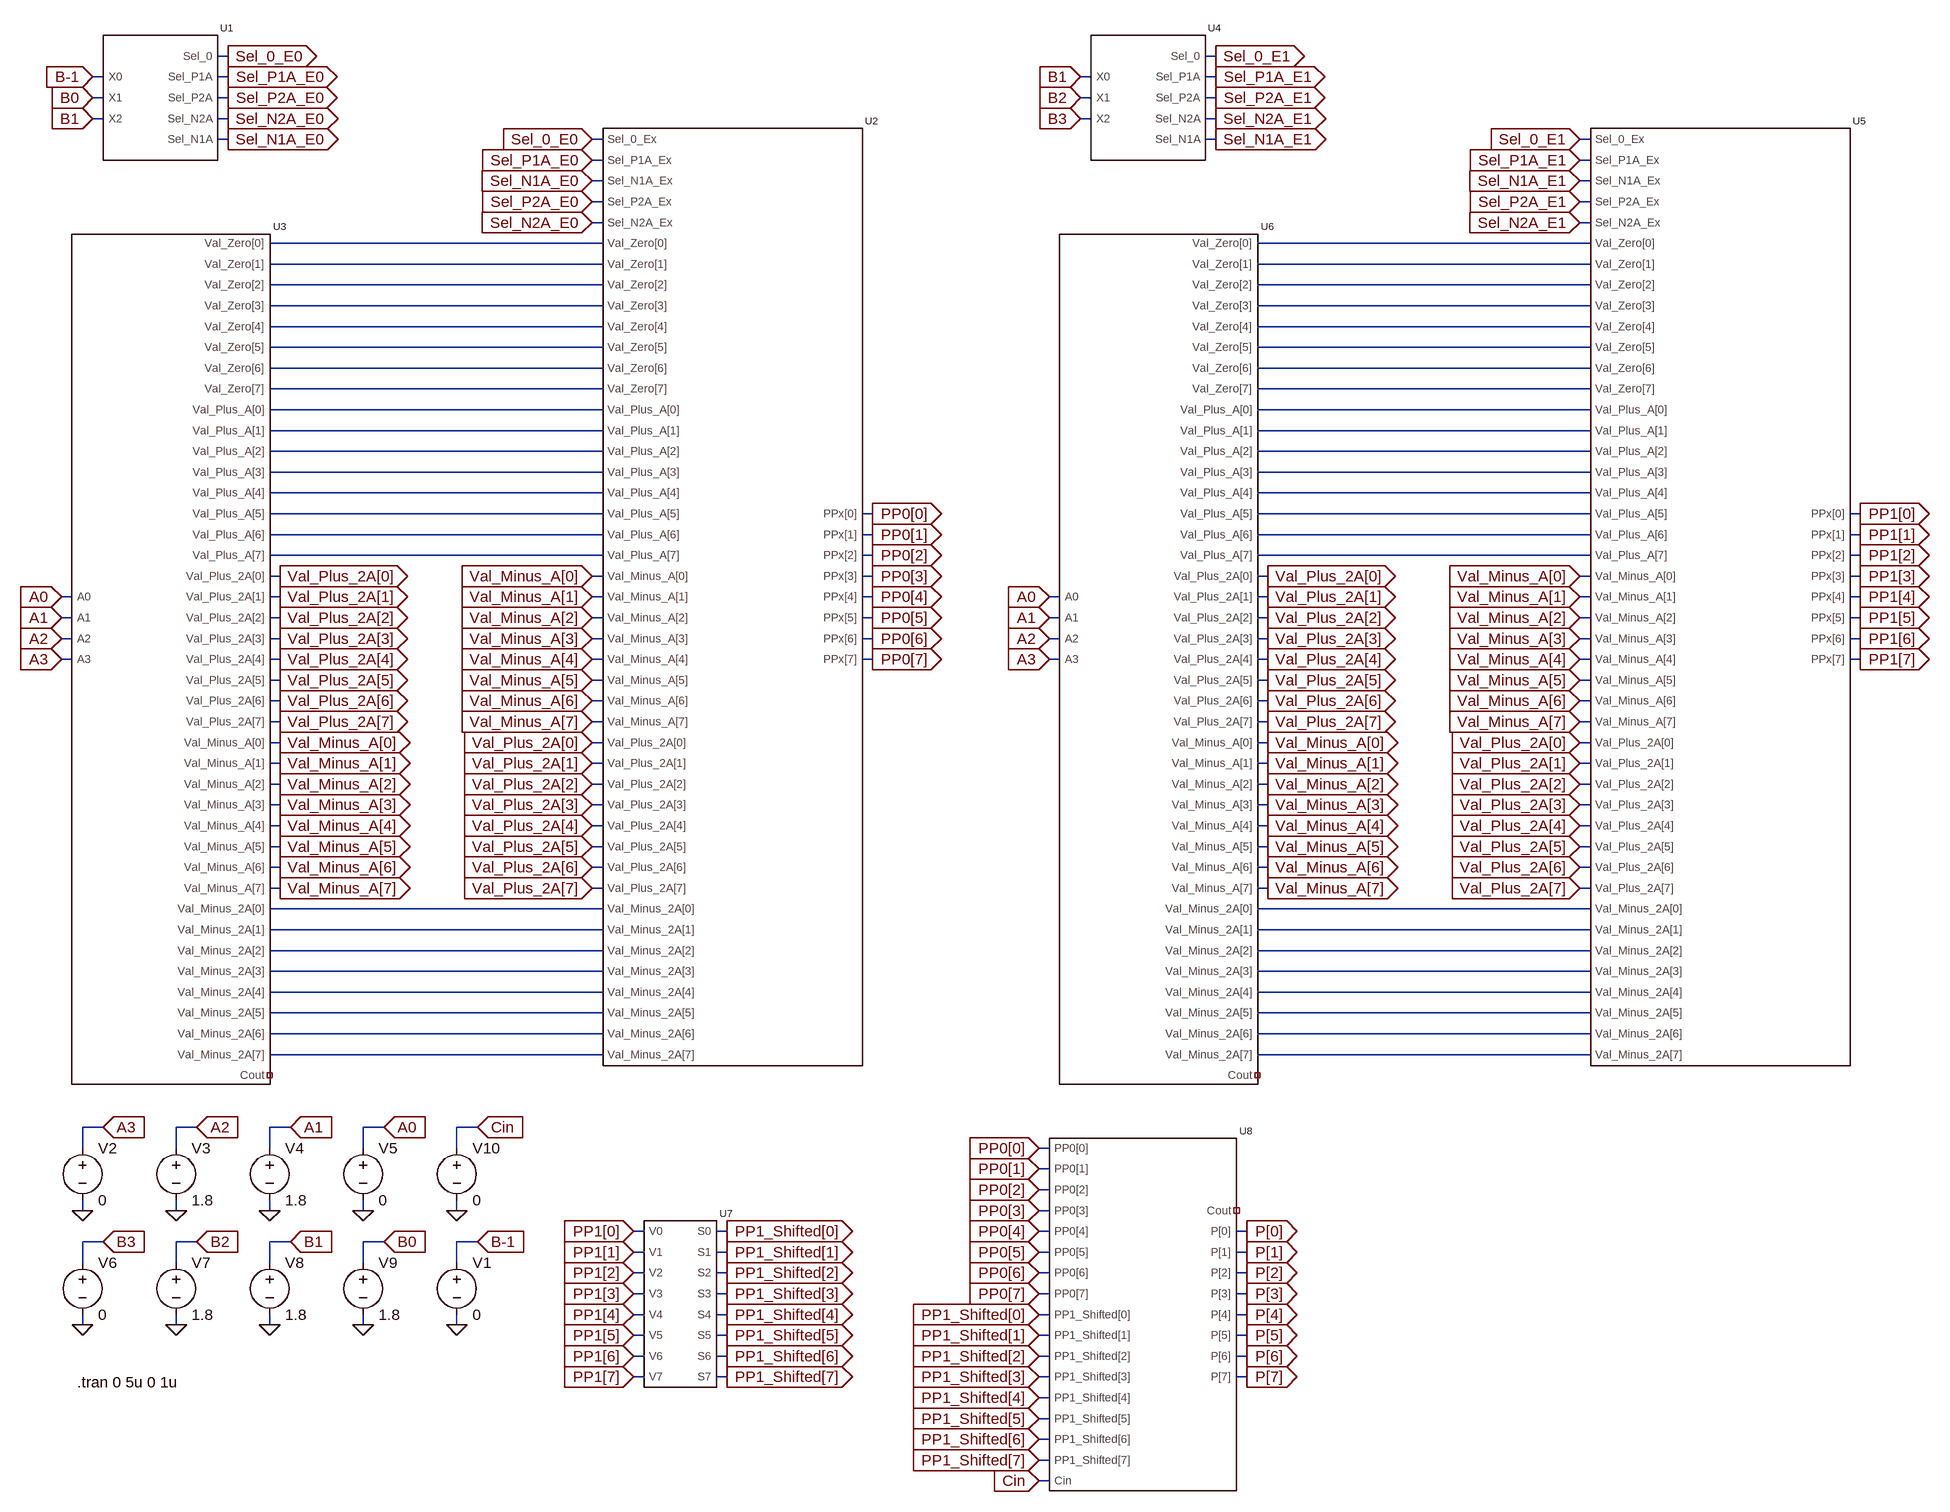
[diagram p0: schematic FINAL_DESIGN_all_blocks_included.asc]
FINAL_DESIGN_all_blocks_included.asc, the LTspice schematic file:
Version 4.1
SHEET 1 5200 2308
WIRE 1248 -96 1232 -96
WIRE 2768 -96 2752 -96
WIRE 1056 -64 1040 -64
WIRE 1248 -64 1232 -64
WIRE 2576 -64 2560 -64
WIRE 2768 -64 2752 -64
WIRE 1056 -32 1040 -32
WIRE 1248 -32 1232 -32
WIRE 2576 -32 2560 -32
WIRE 2768 -32 2752 -32
WIRE 1056 0 1040 0
WIRE 1248 0 1232 0
WIRE 2576 0 2560 0
WIRE 2768 0 2752 0
WIRE 1248 32 1232 32
WIRE 1824 32 1808 32
WIRE 2768 32 2752 32
WIRE 3344 32 3328 32
WIRE 1824 64 1808 64
WIRE 3344 64 3328 64
WIRE 1824 96 1808 96
WIRE 3344 96 3328 96
WIRE 1824 128 1808 128
WIRE 3344 128 3328 128
WIRE 1824 160 1808 160
WIRE 3344 160 3328 160
WIRE 1824 192 1312 192
WIRE 3344 192 2832 192
WIRE 1824 224 1312 224
WIRE 3344 224 2832 224
WIRE 1824 256 1312 256
WIRE 3344 256 2832 256
WIRE 1824 288 1312 288
WIRE 3344 288 2832 288
WIRE 1824 320 1312 320
WIRE 3344 320 2832 320
WIRE 1824 352 1312 352
WIRE 3344 352 2832 352
WIRE 1824 384 1312 384
WIRE 3344 384 2832 384
WIRE 1824 416 1312 416
WIRE 3344 416 2832 416
WIRE 1824 448 1312 448
WIRE 3344 448 2832 448
WIRE 1824 480 1312 480
WIRE 3344 480 2832 480
WIRE 1824 512 1312 512
WIRE 3344 512 2832 512
WIRE 1824 544 1312 544
WIRE 3344 544 2832 544
WIRE 1824 576 1312 576
WIRE 3344 576 2832 576
WIRE 1824 608 1312 608
WIRE 2240 608 2224 608
WIRE 3344 608 2832 608
WIRE 3760 608 3744 608
WIRE 1824 640 1312 640
WIRE 2240 640 2224 640
WIRE 3344 640 2832 640
WIRE 3760 640 3744 640
WIRE 1824 672 1312 672
WIRE 2240 672 2224 672
WIRE 3344 672 2832 672
WIRE 3760 672 3744 672
WIRE 1328 704 1312 704
WIRE 1824 704 1808 704
WIRE 2240 704 2224 704
WIRE 2848 704 2832 704
WIRE 3344 704 3328 704
WIRE 3760 704 3744 704
WIRE 1008 736 992 736
WIRE 1328 736 1312 736
WIRE 1824 736 1808 736
WIRE 2240 736 2224 736
WIRE 2528 736 2512 736
WIRE 2848 736 2832 736
WIRE 3344 736 3328 736
WIRE 3760 736 3744 736
WIRE 1008 768 992 768
WIRE 1328 768 1312 768
WIRE 1824 768 1808 768
WIRE 2240 768 2224 768
WIRE 2528 768 2512 768
WIRE 2848 768 2832 768
WIRE 3344 768 3328 768
WIRE 3760 768 3744 768
WIRE 1008 800 992 800
WIRE 1328 800 1312 800
WIRE 1824 800 1808 800
WIRE 2240 800 2224 800
WIRE 2528 800 2512 800
WIRE 2848 800 2832 800
WIRE 3344 800 3328 800
WIRE 3760 800 3744 800
WIRE 1008 832 992 832
WIRE 1328 832 1312 832
WIRE 1824 832 1808 832
WIRE 2240 832 2224 832
WIRE 2528 832 2512 832
WIRE 2848 832 2832 832
WIRE 3344 832 3328 832
WIRE 3760 832 3744 832
WIRE 1328 864 1312 864
WIRE 1824 864 1808 864
WIRE 2848 864 2832 864
WIRE 3344 864 3328 864
WIRE 1328 896 1312 896
WIRE 1824 896 1808 896
WIRE 2848 896 2832 896
WIRE 3344 896 3328 896
WIRE 1328 928 1312 928
WIRE 1824 928 1808 928
WIRE 2848 928 2832 928
WIRE 3344 928 3328 928
WIRE 1328 960 1312 960
WIRE 1824 960 1808 960
WIRE 2848 960 2832 960
WIRE 3344 960 3328 960
WIRE 1328 992 1312 992
WIRE 1824 992 1808 992
WIRE 2848 992 2832 992
WIRE 3344 992 3328 992
WIRE 1328 1024 1312 1024
WIRE 1824 1024 1808 1024
WIRE 2848 1024 2832 1024
WIRE 3344 1024 3328 1024
WIRE 1328 1056 1312 1056
WIRE 1824 1056 1808 1056
WIRE 2848 1056 2832 1056
WIRE 3344 1056 3328 1056
WIRE 1328 1088 1312 1088
WIRE 1824 1088 1808 1088
WIRE 2848 1088 2832 1088
WIRE 3344 1088 3328 1088
WIRE 1328 1120 1312 1120
WIRE 1824 1120 1808 1120
WIRE 2848 1120 2832 1120
WIRE 3344 1120 3328 1120
WIRE 1328 1152 1312 1152
WIRE 1824 1152 1808 1152
WIRE 2848 1152 2832 1152
WIRE 3344 1152 3328 1152
WIRE 1328 1184 1312 1184
WIRE 1824 1184 1808 1184
WIRE 2848 1184 2832 1184
WIRE 3344 1184 3328 1184
WIRE 1824 1216 1312 1216
WIRE 3344 1216 2832 1216
WIRE 1824 1248 1312 1248
WIRE 3344 1248 2832 1248
WIRE 1824 1280 1312 1280
WIRE 3344 1280 2832 1280
WIRE 1824 1312 1312 1312
WIRE 3344 1312 2832 1312
WIRE 1824 1344 1312 1344
WIRE 3344 1344 2832 1344
WIRE 1824 1376 1312 1376
WIRE 3344 1376 2832 1376
WIRE 1824 1408 1312 1408
WIRE 3344 1408 2832 1408
WIRE 1824 1440 1312 1440
WIRE 3344 1440 2832 1440
WIRE 1056 1552 1024 1552
WIRE 1200 1552 1168 1552
WIRE 1344 1552 1312 1552
WIRE 1488 1552 1456 1552
WIRE 1632 1552 1600 1552
WIRE 1024 1584 1024 1552
WIRE 1168 1584 1168 1552
WIRE 1312 1584 1312 1552
WIRE 1456 1584 1456 1552
WIRE 1600 1584 1600 1552
WIRE 2512 1584 2496 1584
WIRE 2512 1616 2496 1616
WIRE 2512 1648 2496 1648
WIRE 1024 1680 1024 1664
WIRE 1168 1680 1168 1664
WIRE 1312 1680 1312 1664
WIRE 1456 1680 1456 1664
WIRE 1600 1680 1600 1664
WIRE 2512 1680 2496 1680
WIRE 1888 1712 1872 1712
WIRE 2016 1712 2000 1712
WIRE 2512 1712 2496 1712
WIRE 2816 1712 2800 1712
WIRE 1056 1728 1024 1728
WIRE 1200 1728 1168 1728
WIRE 1344 1728 1312 1728
WIRE 1488 1728 1456 1728
WIRE 1632 1728 1600 1728
WIRE 1888 1744 1872 1744
WIRE 2016 1744 2000 1744
WIRE 2512 1744 2496 1744
WIRE 2816 1744 2800 1744
WIRE 1024 1760 1024 1728
WIRE 1168 1760 1168 1728
WIRE 1312 1760 1312 1728
WIRE 1456 1760 1456 1728
WIRE 1600 1760 1600 1728
WIRE 1888 1776 1872 1776
WIRE 2016 1776 2000 1776
WIRE 2512 1776 2496 1776
WIRE 2816 1776 2800 1776
WIRE 1888 1808 1872 1808
WIRE 2016 1808 2000 1808
WIRE 2512 1808 2496 1808
WIRE 2816 1808 2800 1808
WIRE 1888 1840 1872 1840
WIRE 2016 1840 2000 1840
WIRE 2512 1840 2496 1840
WIRE 2816 1840 2800 1840
WIRE 1024 1856 1024 1840
WIRE 1168 1856 1168 1840
WIRE 1312 1856 1312 1840
WIRE 1456 1856 1456 1840
WIRE 1600 1856 1600 1840
WIRE 1888 1872 1872 1872
WIRE 2016 1872 2000 1872
WIRE 2512 1872 2496 1872
WIRE 2816 1872 2800 1872
WIRE 1888 1904 1872 1904
WIRE 2016 1904 2000 1904
WIRE 2512 1904 2496 1904
WIRE 2816 1904 2800 1904
WIRE 1888 1936 1872 1936
WIRE 2016 1936 2000 1936
WIRE 2512 1936 2496 1936
WIRE 2816 1936 2800 1936
WIRE 2512 1968 2496 1968
WIRE 2512 2000 2496 2000
WIRE 2512 2032 2496 2032
WIRE 2512 2064 2496 2064
WIRE 2512 2096 2496 2096
FLAG 1040 0 B1
IOPIN 1040 0 In
FLAG 1040 -32 B0
IOPIN 1040 -32 In
FLAG 1040 -64 B-1
IOPIN 1040 -64 In
FLAG 1248 -96 Sel_0_E0
IOPIN 1248 -96 Out
FLAG 1248 -64 Sel_P1A_E0
IOPIN 1248 -64 Out
FLAG 1248 -32 Sel_P2A_E0
IOPIN 1248 -32 Out
FLAG 1248 0 Sel_N2A_E0
IOPIN 1248 0 Out
FLAG 1248 32 Sel_N1A_E0
IOPIN 1248 32 Out
FLAG 1808 32 Sel_0_E0
IOPIN 1808 32 In
FLAG 1808 64 Sel_P1A_E0
IOPIN 1808 64 In
FLAG 1808 128 Sel_P2A_E0
IOPIN 1808 128 In
FLAG 1808 160 Sel_N2A_E0
IOPIN 1808 160 In
FLAG 1808 96 Sel_N1A_E0
IOPIN 1808 96 In
FLAG 1328 704 Val_Plus_2A[0]
IOPIN 1328 704 Out
FLAG 1328 736 Val_Plus_2A[1]
IOPIN 1328 736 Out
FLAG 1328 768 Val_Plus_2A[2]
IOPIN 1328 768 Out
FLAG 1328 800 Val_Plus_2A[3]
IOPIN 1328 800 Out
FLAG 1328 832 Val_Plus_2A[4]
IOPIN 1328 832 Out
FLAG 1328 864 Val_Plus_2A[5]
IOPIN 1328 864 Out
FLAG 1328 896 Val_Plus_2A[6]
IOPIN 1328 896 Out
FLAG 1328 928 Val_Plus_2A[7]
IOPIN 1328 928 Out
FLAG 1808 960 Val_Plus_2A[0]
IOPIN 1808 960 In
FLAG 1808 992 Val_Plus_2A[1]
IOPIN 1808 992 In
FLAG 1808 1024 Val_Plus_2A[2]
IOPIN 1808 1024 In
FLAG 1808 1056 Val_Plus_2A[3]
IOPIN 1808 1056 In
FLAG 1808 1088 Val_Plus_2A[4]
IOPIN 1808 1088 In
FLAG 1808 1120 Val_Plus_2A[5]
IOPIN 1808 1120 In
FLAG 1808 1152 Val_Plus_2A[6]
IOPIN 1808 1152 In
FLAG 1808 1184 Val_Plus_2A[7]
IOPIN 1808 1184 In
FLAG 1328 960 Val_Minus_A[0]
IOPIN 1328 960 Out
FLAG 1328 992 Val_Minus_A[1]
IOPIN 1328 992 Out
FLAG 1328 1024 Val_Minus_A[2]
IOPIN 1328 1024 Out
FLAG 1328 1056 Val_Minus_A[3]
IOPIN 1328 1056 Out
FLAG 1328 1088 Val_Minus_A[4]
IOPIN 1328 1088 Out
FLAG 1328 1120 Val_Minus_A[5]
IOPIN 1328 1120 Out
FLAG 1328 1152 Val_Minus_A[6]
IOPIN 1328 1152 Out
FLAG 1328 1184 Val_Minus_A[7]
IOPIN 1328 1184 Out
FLAG 1808 704 Val_Minus_A[0]
IOPIN 1808 704 In
FLAG 1808 736 Val_Minus_A[1]
IOPIN 1808 736 In
FLAG 1808 768 Val_Minus_A[2]
IOPIN 1808 768 In
FLAG 1808 800 Val_Minus_A[3]
IOPIN 1808 800 In
FLAG 1808 832 Val_Minus_A[4]
IOPIN 1808 832 In
FLAG 1808 864 Val_Minus_A[5]
IOPIN 1808 864 In
FLAG 1808 896 Val_Minus_A[6]
IOPIN 1808 896 In
FLAG 1808 928 Val_Minus_A[7]
IOPIN 1808 928 In
FLAG 2240 608 PP0[0]
IOPIN 2240 608 Out
FLAG 2240 640 PP0[1]
IOPIN 2240 640 Out
FLAG 2240 672 PP0[2]
IOPIN 2240 672 Out
FLAG 2240 704 PP0[3]
IOPIN 2240 704 Out
FLAG 2240 736 PP0[4]
IOPIN 2240 736 Out
FLAG 2240 768 PP0[5]
IOPIN 2240 768 Out
FLAG 2240 800 PP0[6]
IOPIN 2240 800 Out
FLAG 2240 832 PP0[7]
IOPIN 2240 832 Out
FLAG 992 736 A0
IOPIN 992 736 In
FLAG 992 768 A1
IOPIN 992 768 In
FLAG 992 800 A2
IOPIN 992 800 In
FLAG 992 832 A3
IOPIN 992 832 In
FLAG 2560 0 B3
IOPIN 2560 0 In
FLAG 2560 -32 B2
IOPIN 2560 -32 In
FLAG 2560 -64 B1
IOPIN 2560 -64 In
FLAG 2768 -96 Sel_0_E1
IOPIN 2768 -96 Out
FLAG 2768 -64 Sel_P1A_E1
IOPIN 2768 -64 Out
FLAG 2768 -32 Sel_P2A_E1
IOPIN 2768 -32 Out
FLAG 2768 0 Sel_N2A_E1
IOPIN 2768 0 Out
FLAG 2768 32 Sel_N1A_E1
IOPIN 2768 32 Out
FLAG 3328 32 Sel_0_E1
IOPIN 3328 32 In
FLAG 3328 64 Sel_P1A_E1
IOPIN 3328 64 In
FLAG 3328 128 Sel_P2A_E1
IOPIN 3328 128 In
FLAG 3328 160 Sel_N2A_E1
IOPIN 3328 160 In
FLAG 3328 96 Sel_N1A_E1
IOPIN 3328 96 In
FLAG 2848 704 Val_Plus_2A[0]
IOPIN 2848 704 Out
FLAG 2848 736 Val_Plus_2A[1]
IOPIN 2848 736 Out
FLAG 2848 768 Val_Plus_2A[2]
IOPIN 2848 768 Out
FLAG 2848 800 Val_Plus_2A[3]
IOPIN 2848 800 Out
FLAG 2848 832 Val_Plus_2A[4]
IOPIN 2848 832 Out
FLAG 2848 864 Val_Plus_2A[5]
IOPIN 2848 864 Out
FLAG 2848 896 Val_Plus_2A[6]
IOPIN 2848 896 Out
FLAG 2848 928 Val_Plus_2A[7]
IOPIN 2848 928 Out
FLAG 3328 960 Val_Plus_2A[0]
IOPIN 3328 960 In
FLAG 3328 992 Val_Plus_2A[1]
IOPIN 3328 992 In
FLAG 3328 1024 Val_Plus_2A[2]
IOPIN 3328 1024 In
FLAG 3328 1056 Val_Plus_2A[3]
IOPIN 3328 1056 In
FLAG 3328 1088 Val_Plus_2A[4]
IOPIN 3328 1088 In
FLAG 3328 1120 Val_Plus_2A[5]
IOPIN 3328 1120 In
FLAG 3328 1152 Val_Plus_2A[6]
IOPIN 3328 1152 In
FLAG 3328 1184 Val_Plus_2A[7]
IOPIN 3328 1184 In
FLAG 2848 960 Val_Minus_A[0]
IOPIN 2848 960 Out
FLAG 2848 992 Val_Minus_A[1]
IOPIN 2848 992 Out
FLAG 2848 1024 Val_Minus_A[2]
IOPIN 2848 1024 Out
FLAG 2848 1056 Val_Minus_A[3]
IOPIN 2848 1056 Out
FLAG 2848 1088 Val_Minus_A[4]
IOPIN 2848 1088 Out
FLAG 2848 1120 Val_Minus_A[5]
IOPIN 2848 1120 Out
FLAG 2848 1152 Val_Minus_A[6]
IOPIN 2848 1152 Out
FLAG 2848 1184 Val_Minus_A[7]
IOPIN 2848 1184 Out
FLAG 3328 704 Val_Minus_A[0]
IOPIN 3328 704 In
FLAG 3328 736 Val_Minus_A[1]
IOPIN 3328 736 In
FLAG 3328 768 Val_Minus_A[2]
IOPIN 3328 768 In
FLAG 3328 800 Val_Minus_A[3]
IOPIN 3328 800 In
FLAG 3328 832 Val_Minus_A[4]
IOPIN 3328 832 In
FLAG 3328 864 Val_Minus_A[5]
IOPIN 3328 864 In
FLAG 3328 896 Val_Minus_A[6]
IOPIN 3328 896 In
FLAG 3328 928 Val_Minus_A[7]
IOPIN 3328 928 In
FLAG 3760 608 PP1[0]
IOPIN 3760 608 Out
FLAG 3760 640 PP1[1]
IOPIN 3760 640 Out
FLAG 3760 672 PP1[2]
IOPIN 3760 672 Out
FLAG 3760 704 PP1[3]
IOPIN 3760 704 Out
FLAG 3760 736 PP1[4]
IOPIN 3760 736 Out
FLAG 3760 768 PP1[5]
IOPIN 3760 768 Out
FLAG 3760 800 PP1[6]
IOPIN 3760 800 Out
FLAG 3760 832 PP1[7]
IOPIN 3760 832 Out
FLAG 2512 736 A0
IOPIN 2512 736 In
FLAG 2512 768 A1
IOPIN 2512 768 In
FLAG 2512 800 A2
IOPIN 2512 800 In
FLAG 2512 832 A3
IOPIN 2512 832 In
FLAG 1024 1680 0
FLAG 1168 1680 0
FLAG 1056 1552 A3
IOPIN 1056 1552 In
FLAG 1200 1552 A2
IOPIN 1200 1552 In
FLAG 1312 1680 0
FLAG 1456 1680 0
FLAG 1344 1552 A1
IOPIN 1344 1552 In
FLAG 1488 1552 A0
IOPIN 1488 1552 In
FLAG 1024 1856 0
FLAG 1168 1856 0
FLAG 1056 1728 B3
IOPIN 1056 1728 In
FLAG 1200 1728 B2
IOPIN 1200 1728 In
FLAG 1312 1856 0
FLAG 1456 1856 0
FLAG 1344 1728 B1
IOPIN 1344 1728 In
FLAG 1488 1728 B0
IOPIN 1488 1728 In
FLAG 1600 1856 0
FLAG 1632 1728 B-1
IOPIN 1632 1728 In
FLAG 1872 1712 PP1[0]
IOPIN 1872 1712 In
FLAG 1872 1744 PP1[1]
IOPIN 1872 1744 In
FLAG 1872 1776 PP1[2]
IOPIN 1872 1776 In
FLAG 1872 1808 PP1[3]
IOPIN 1872 1808 In
FLAG 1872 1840 PP1[4]
IOPIN 1872 1840 In
FLAG 1872 1872 PP1[5]
IOPIN 1872 1872 In
FLAG 1872 1904 PP1[6]
IOPIN 1872 1904 In
FLAG 1872 1936 PP1[7]
IOPIN 1872 1936 In
FLAG 2496 1584 PP0[0]
IOPIN 2496 1584 In
FLAG 2496 1616 PP0[1]
IOPIN 2496 1616 In
FLAG 2496 1648 PP0[2]
IOPIN 2496 1648 In
FLAG 2496 1680 PP0[3]
IOPIN 2496 1680 In
FLAG 2496 1712 PP0[4]
IOPIN 2496 1712 In
FLAG 2496 1744 PP0[5]
IOPIN 2496 1744 In
FLAG 2496 1776 PP0[6]
IOPIN 2496 1776 In
FLAG 2496 1808 PP0[7]
IOPIN 2496 1808 In
FLAG 2016 1712 PP1_Shifted[0]
IOPIN 2016 1712 Out
FLAG 2016 1744 PP1_Shifted[1]
IOPIN 2016 1744 Out
FLAG 2016 1776 PP1_Shifted[2]
IOPIN 2016 1776 Out
FLAG 2016 1808 PP1_Shifted[3]
IOPIN 2016 1808 Out
FLAG 2016 1840 PP1_Shifted[4]
IOPIN 2016 1840 Out
FLAG 2016 1872 PP1_Shifted[5]
IOPIN 2016 1872 Out
FLAG 2016 1904 PP1_Shifted[6]
IOPIN 2016 1904 Out
FLAG 2016 1936 PP1_Shifted[7]
IOPIN 2016 1936 Out
FLAG 2496 1840 PP1_Shifted[0]
IOPIN 2496 1840 In
FLAG 2496 1872 PP1_Shifted[1]
IOPIN 2496 1872 In
FLAG 2496 1904 PP1_Shifted[2]
IOPIN 2496 1904 In
FLAG 2496 1936 PP1_Shifted[3]
IOPIN 2496 1936 In
FLAG 2496 1968 PP1_Shifted[4]
IOPIN 2496 1968 In
FLAG 2496 2000 PP1_Shifted[5]
IOPIN 2496 2000 In
FLAG 2496 2032 PP1_Shifted[6]
IOPIN 2496 2032 In
FLAG 2496 2064 PP1_Shifted[7]
IOPIN 2496 2064 In
FLAG 2496 2096 Cin
IOPIN 2496 2096 In
FLAG 1600 1680 0
FLAG 1632 1552 Cin
IOPIN 1632 1552 In
FLAG 2816 1712 P[0]
IOPIN 2816 1712 Out
FLAG 2816 1744 P[1]
IOPIN 2816 1744 Out
FLAG 2816 1776 P[2]
IOPIN 2816 1776 Out
FLAG 2816 1808 P[3]
IOPIN 2816 1808 Out
FLAG 2816 1840 P[4]
IOPIN 2816 1840 Out
FLAG 2816 1872 P[5]
IOPIN 2816 1872 Out
FLAG 2816 1904 P[6]
IOPIN 2816 1904 Out
FLAG 2816 1936 P[7]
IOPIN 2816 1936 Out
SYMBOL Encoder 1152 0 R0
SYMATTR InstName U1
SYMBOL MUX 2000 304 R0
SYMATTR InstName U2
SYMBOL MMG_Block 1136 544 R0
SYMATTR InstName U3
SYMBOL Encoder 2672 0 R0
SYMATTR InstName U4
SYMBOL MUX 3520 304 R0
SYMATTR InstName U5
SYMBOL MMG_Block 2656 544 R0
SYMATTR InstName U6
SYMBOL voltage 1024 1568 R0
WINDOW 123 0 0 Left 0
WINDOW 39 0 0 Left 0
SYMATTR InstName V2
SYMATTR Value 0
SYMBOL voltage 1168 1568 R0
WINDOW 123 0 0 Left 0
WINDOW 39 0 0 Left 0
SYMATTR InstName V3
SYMATTR Value 1.8
SYMBOL voltage 1312 1568 R0
WINDOW 123 0 0 Left 0
WINDOW 39 0 0 Left 0
SYMATTR InstName V4
SYMATTR Value 1.8
SYMBOL voltage 1456 1568 R0
WINDOW 123 0 0 Left 0
WINDOW 39 0 0 Left 0
SYMATTR InstName V5
SYMATTR Value 0
SYMBOL voltage 1024 1744 R0
WINDOW 123 0 0 Left 0
WINDOW 39 0 0 Left 0
SYMATTR InstName V6
SYMATTR Value 0
SYMBOL voltage 1168 1744 R0
WINDOW 123 0 0 Left 0
WINDOW 39 0 0 Left 0
SYMATTR InstName V7
SYMATTR Value 1.8
SYMBOL voltage 1312 1744 R0
WINDOW 123 0 0 Left 0
WINDOW 39 0 0 Left 0
SYMATTR InstName V8
SYMATTR Value 1.8
SYMBOL voltage 1456 1744 R0
WINDOW 123 0 0 Left 0
WINDOW 39 0 0 Left 0
SYMATTR InstName V9
SYMATTR Value 1.8
SYMBOL voltage 1600 1744 R0
WINDOW 123 0 0 Left 0
WINDOW 39 0 0 Left 0
SYMATTR InstName V1
SYMATTR Value 0
SYMBOL Shifter_Block 1952 1824 R0
SYMATTR InstName U7
SYMBOL voltage 1600 1568 R0
WINDOW 123 0 0 Left 0
WINDOW 39 0 0 Left 0
SYMATTR InstName V10
SYMATTR Value 0
SYMBOL Summation_Block 2592 1696 R0
SYMATTR InstName U8
TEXT 1016 1944 Left 2 !.tran 0 5u 0 1u

The netlist it stands for:
* FINAL_DESIGN_all_blocks_included.asc
X§U1 B-1 B0 B1 Sel_0_E0 Sel_P1A_E0 Sel_P2A_E0 Sel_N2A_E0 Sel_N1A_E0 Encoder  ; pins X0 X1 X2 Sel_0 Sel_P1A Sel_P2A Sel_N2A Sel_N1A
X§U2 Sel_0_E0 Sel_P1A_E0 Sel_N1A_E0 Sel_P2A_E0 Sel_N2A_E0 N001 N003 N005 N007 N009 N011 N013 N015 N017 N019 N021 N023 N025 N027 N029 N031 Val_Minus_A[0] Val_Minus_A[1] Val_Minus_A[2] Val_Minus_A[3] Val_Minus_A[4] Val_Minus_A[5] Val_Minus_A[6] Val_Minus_A[7] Val_Plus_2A[0] Val_Plus_2A[1] Val_Plus_2A[2] Val_Plus_2A[3] Val_Plus_2A[4] Val_Plus_2A[5] Val_Plus_2A[6] Val_Plus_2A[7] N033 N035 N037 N039 N041 N043 N045 N047 PP0[0] PP0[1] PP0[2] PP0[3] PP0[4] PP0[5] PP0[6] PP0[7] MUX  ; pins Sel_0_Ex Sel_P1A_Ex Sel_N1A_Ex Sel_P2A_Ex Sel_N2A_Ex Val_Zero[0] Val_Zero[1] Val_Zero[2] Val_Zero[3] Val_Zero[4] Val_Zero[5] Val_Zero[6] Val_Zero[7] Val_Plus_A[0] Val_Plus_A[1] Val_Plus_A[2] Val_Plus_A[3] Val_Plus_A[4] Val_Plus_A[5] Val_Plus_A[6] Val_Plus_A[7] Val_Minus_A[0] Val_Minus_A[1] Val_Minus_A[2] Val_Minus_A[3] Val_Minus_A[4] Val_Minus_A[5] Val_Minus_A[6] Val_Minus_A[7] Val_Plus_2A[0] Val_Plus_2A[1] Val_Plus_2A[2] Val_Plus_2A[3] Val_Plus_2A[4] Val_Plus_2A[5] Val_Plus_2A[6] Val_Plus_2A[7] Val_Minus_2A[0] Val_Minus_2A[1] Val_Minus_2A[2] Val_Minus_2A[3] Val_Minus_2A[4] Val_Minus_2A[5] Val_Minus_2A[6] Val_Minus_2A[7] PPx[0] PPx[1] PPx[2] PPx[3] PPx[4] PPx[5] PPx[6] PPx[7]
X§U3 A0 A1 A2 A3 N001 N003 N005 N007 N009 N011 N013 N015 N017 N019 N021 N023 N025 N027 N029 N031 Val_Plus_2A[0] Val_Plus_2A[1] Val_Plus_2A[2] Val_Plus_2A[3] Val_Plus_2A[4] Val_Plus_2A[5] Val_Plus_2A[6] Val_Plus_2A[7] Val_Minus_A[0] Val_Minus_A[1] Val_Minus_A[2] Val_Minus_A[3] Val_Minus_A[4] Val_Minus_A[5] Val_Minus_A[6] Val_Minus_A[7] N033 N035 N037 N039 N041 N043 N045 N047 NC_01 MMG_Block  ; pins A0 A1 A2 A3 Val_Zero[0] Val_Zero[1] Val_Zero[2] Val_Zero[3] Val_Zero[4] Val_Zero[5] Val_Zero[6] Val_Zero[7] Val_Plus_A[0] Val_Plus_A[1] Val_Plus_A[2] Val_Plus_A[3] Val_Plus_A[4] Val_Plus_A[5] Val_Plus_A[6] Val_Plus_A[7] Val_Plus_2A[0] Val_Plus_2A[1] Val_Plus_2A[2] Val_Plus_2A[3] Val_Plus_2A[4] Val_Plus_2A[5] Val_Plus_2A[6] Val_Plus_2A[7] Val_Minus_A[0] Val_Minus_A[1] Val_Minus_A[2] Val_Minus_A[3] Val_Minus_A[4] Val_Minus_A[5] Val_Minus_A[6] Val_Minus_A[7] Val_Minus_2A[0] Val_Minus_2A[1] Val_Minus_2A[2] Val_Minus_2A[3] Val_Minus_2A[4] Val_Minus_2A[5] Val_Minus_2A[6] Val_Minus_2A[7] Cout
X§U4 B1 B2 B3 Sel_0_E1 Sel_P1A_E1 Sel_P2A_E1 Sel_N2A_E1 Sel_N1A_E1 Encoder  ; pins X0 X1 X2 Sel_0 Sel_P1A Sel_P2A Sel_N2A Sel_N1A
X§U5 Sel_0_E1 Sel_P1A_E1 Sel_N1A_E1 Sel_P2A_E1 Sel_N2A_E1 N002 N004 N006 N008 N010 N012 N014 N016 N018 N020 N022 N024 N026 N028 N030 N032 Val_Minus_A[0] Val_Minus_A[1] Val_Minus_A[2] Val_Minus_A[3] Val_Minus_A[4] Val_Minus_A[5] Val_Minus_A[6] Val_Minus_A[7] Val_Plus_2A[0] Val_Plus_2A[1] Val_Plus_2A[2] Val_Plus_2A[3] Val_Plus_2A[4] Val_Plus_2A[5] Val_Plus_2A[6] Val_Plus_2A[7] N034 N036 N038 N040 N042 N044 N046 N048 PP1[0] PP1[1] PP1[2] PP1[3] PP1[4] PP1[5] PP1[6] PP1[7] MUX  ; pins Sel_0_Ex Sel_P1A_Ex Sel_N1A_Ex Sel_P2A_Ex Sel_N2A_Ex Val_Zero[0] Val_Zero[1] Val_Zero[2] Val_Zero[3] Val_Zero[4] Val_Zero[5] Val_Zero[6] Val_Zero[7] Val_Plus_A[0] Val_Plus_A[1] Val_Plus_A[2] Val_Plus_A[3] Val_Plus_A[4] Val_Plus_A[5] Val_Plus_A[6] Val_Plus_A[7] Val_Minus_A[0] Val_Minus_A[1] Val_Minus_A[2] Val_Minus_A[3] Val_Minus_A[4] Val_Minus_A[5] Val_Minus_A[6] Val_Minus_A[7] Val_Plus_2A[0] Val_Plus_2A[1] Val_Plus_2A[2] Val_Plus_2A[3] Val_Plus_2A[4] Val_Plus_2A[5] Val_Plus_2A[6] Val_Plus_2A[7] Val_Minus_2A[0] Val_Minus_2A[1] Val_Minus_2A[2] Val_Minus_2A[3] Val_Minus_2A[4] Val_Minus_2A[5] Val_Minus_2A[6] Val_Minus_2A[7] PPx[0] PPx[1] PPx[2] PPx[3] PPx[4] PPx[5] PPx[6] PPx[7]
X§U6 A0 A1 A2 A3 N002 N004 N006 N008 N010 N012 N014 N016 N018 N020 N022 N024 N026 N028 N030 N032 Val_Plus_2A[0] Val_Plus_2A[1] Val_Plus_2A[2] Val_Plus_2A[3] Val_Plus_2A[4] Val_Plus_2A[5] Val_Plus_2A[6] Val_Plus_2A[7] Val_Minus_A[0] Val_Minus_A[1] Val_Minus_A[2] Val_Minus_A[3] Val_Minus_A[4] Val_Minus_A[5] Val_Minus_A[6] Val_Minus_A[7] N034 N036 N038 N040 N042 N044 N046 N048 NC_02 MMG_Block  ; pins A0 A1 A2 A3 Val_Zero[0] Val_Zero[1] Val_Zero[2] Val_Zero[3] Val_Zero[4] Val_Zero[5] Val_Zero[6] Val_Zero[7] Val_Plus_A[0] Val_Plus_A[1] Val_Plus_A[2] Val_Plus_A[3] Val_Plus_A[4] Val_Plus_A[5] Val_Plus_A[6] Val_Plus_A[7] Val_Plus_2A[0] Val_Plus_2A[1] Val_Plus_2A[2] Val_Plus_2A[3] Val_Plus_2A[4] Val_Plus_2A[5] Val_Plus_2A[6] Val_Plus_2A[7] Val_Minus_A[0] Val_Minus_A[1] Val_Minus_A[2] Val_Minus_A[3] Val_Minus_A[4] Val_Minus_A[5] Val_Minus_A[6] Val_Minus_A[7] Val_Minus_2A[0] Val_Minus_2A[1] Val_Minus_2A[2] Val_Minus_2A[3] Val_Minus_2A[4] Val_Minus_2A[5] Val_Minus_2A[6] Val_Minus_2A[7] Cout
V2 A3 0 0
V3 A2 0 1.8
V4 A1 0 1.8
V5 A0 0 0
V6 B3 0 0
V7 B2 0 1.8
V8 B1 0 1.8
V9 B0 0 1.8
V1 B-1 0 0
X§U7 PP1[0] PP1[1] PP1[2] PP1[3] PP1[4] PP1[5] PP1[6] PP1[7] PP1_Shifted[0] PP1_Shifted[1] PP1_Shifted[2] PP1_Shifted[3] PP1_Shifted[4] PP1_Shifted[5] PP1_Shifted[6] PP1_Shifted[7] Shifter_Block  ; pins V0 V1 V2 V3 V4 V5 V6 V7 S0 S1 S2 S3 S4 S5 S6 S7
V10 Cin 0 0
X§U8 PP0[0] PP0[1] PP0[2] PP0[3] PP0[4] PP0[5] PP0[6] PP0[7] PP1_Shifted[0] PP1_Shifted[1] PP1_Shifted[2] PP1_Shifted[3] PP1_Shifted[4] PP1_Shifted[5] PP1_Shifted[6] PP1_Shifted[7] Cin NC_03 P[0] P[1] P[2] P[3] P[4] P[5] P[6] P[7] Summation_Block  ; pins PP0[0] PP0[1] PP0[2] PP0[3] PP0[4] PP0[5] PP0[6] PP0[7] PP1_Shifted[0] PP1_Shifted[1] PP1_Shifted[2] PP1_Shifted[3] PP1_Shifted[4] PP1_Shifted[5] PP1_Shifted[6] PP1_Shifted[7] Cin Cout P[0] P[1] P[2] P[3] P[4] P[5] P[6] P[7]
.tran 0 5u 0 1u
.lib Encoder.sub
.lib MUX.sub
.lib MMG_Block.sub
.lib Shifter_Block.sub
.lib Summation_Block.sub
.backanno
.end